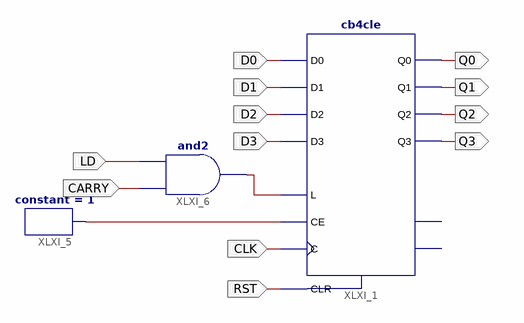
[diagram p0: schematic sheet 1]
// Xilinx ISE schematic Program_Counter.sch (virtex6) as structural Verilog: 3 symbols, 12 ports
module Program_Counter (
  input  D0,
  input  D1,
  input  D2,
  input  D3,
  input  CLK,
  input  RST,
  input  LD,
  input  CARRY,
  output Q0,
  output Q1,
  output Q2,
  output Q3
);

  wire XLXN_23, XLXN_32;

  cb4cle XLXI_1 (
    .C(CLK), .CE(XLXN_23), .CLR(RST), .D0(D0), .D1(D1), .D2(D2), .D3(D3), .L(XLXN_32), .Q0(Q0), .Q1(Q1),
    .Q2(Q2), .Q3(Q3));  // open: CEO, TC
  constant #(.CValue("1")) XLXI_5 (.O(XLXN_23));
  and XLXI_6 (XLXN_32, CARRY, LD);
endmodule
